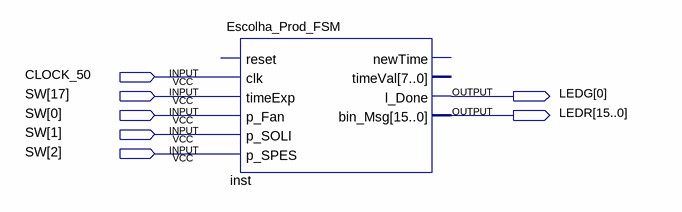
[diagram p0: schematic sheet]
// Quartus schematic Block3.bdf as structural Verilog: 1 symbols, 7 pins
module Block3 (
  input  CLOCK_50,
  input  [17:0] SW,
  output [0:0] LEDG,
  output [15:0] LEDR
);

  Escolha_Prod_FSM inst (
    .clk(CLOCK_50), .timeExp(SW[17]), .p_Fan(SW[0]), .p_SOLI(SW[1]), .p_SPES(SW[2]), .l_Done(LEDG[0]),
    .bin_Msg(LEDR));  // open: reset, newTime, timeVal
endmodule
